# EAGLE design LB_BIT_o9_BARGRAPH-v02(rev1) (EAGLE 6.1)
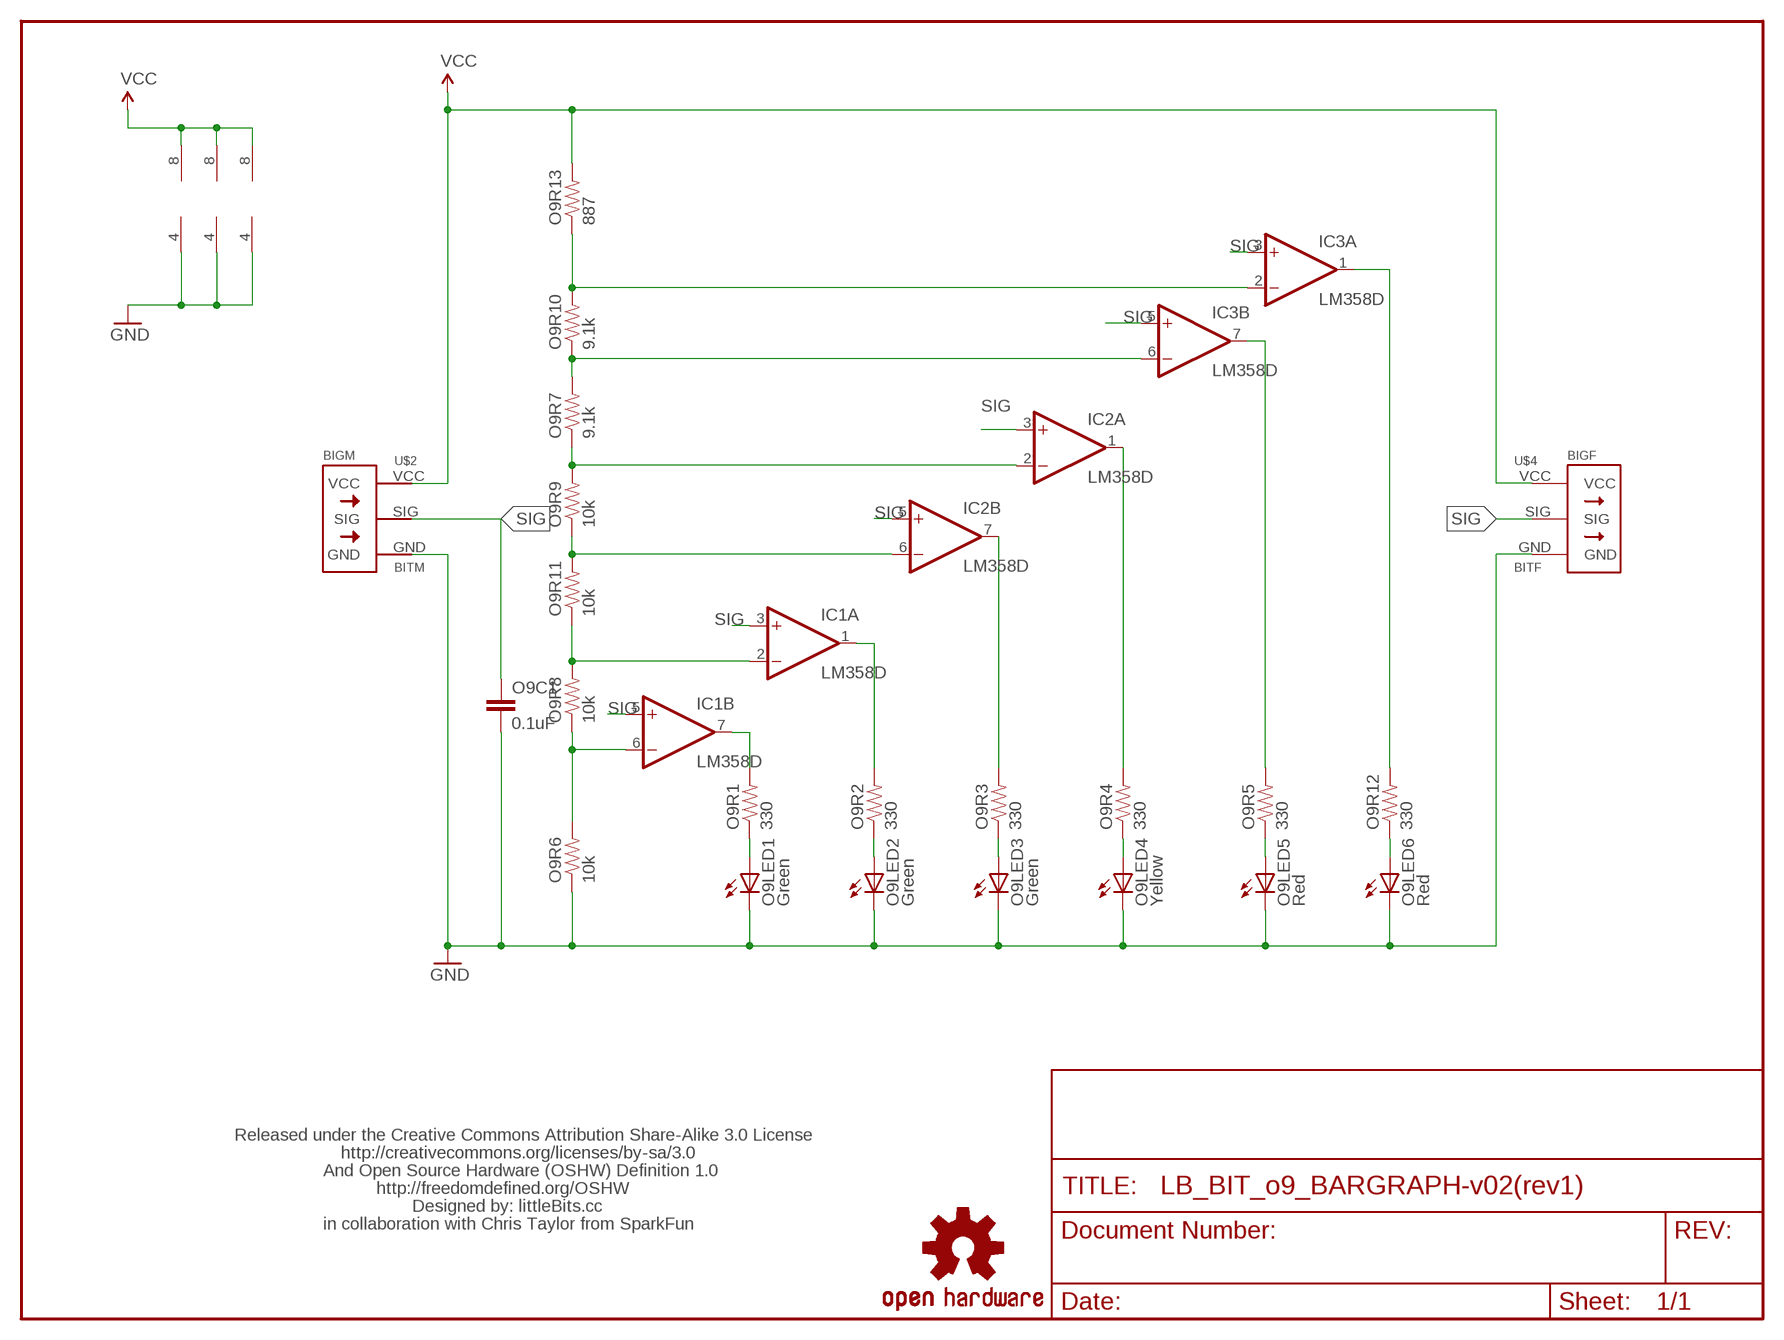
[diagram p0: schematic, sheet 1]

## Parts
IC1  LM358D  [SO08]
IC2  LM358D  [SO08]
IC3  LM358D  [SO08]
O9C1  0.1uF  CAP1206  [1206]
O9LED1  Green  LED1206  [LED-1206]
O9LED2  Green  LED1206  [LED-1206]
O9LED3  Green  LED1206  [LED-1206]
O9LED4  Yellow  LED1206  [LED-1206]
O9LED5  Red  LED1206  [LED-1206]
O9LED6  Red  LED1206  [LED-1206]
O9R1  330  RESISTOR  [0805]
O9R2  330  RESISTOR  [0805]
O9R3  330  RESISTOR  [0805]
O9R4  330  RESISTOR  [0805]
O9R5  330  RESISTOR  [0805]
O9R6  10k  RESISTOR  [0805]
O9R7  9.1k  RESISTOR  [0805]
O9R8  10k  RESISTOR  [0805]
O9R9  10k  RESISTOR  [0805]
O9R10  9.1k  RESISTOR  [0805]
O9R11  10k  RESISTOR  [0805]
O9R12  330  RESISTOR  [0805]
O9R13  887  RESISTOR  [0805]
U$1  LB_CREDITS  [OSHWCREDIT]
U$2  BITM  [BITM]
U$3  OSHW-LOGOL  [OSHW-LOGO-L]
U$4  BITF  [BITM]

## Nets
GND: IC1.4(P:V-) IC2.4(P:V-) IC3.4(P:V-) O9C1.2 O9LED1.C O9LED2.C O9LED3.C O9LED4.C O9LED5.C O9LED6.C O9R6.1 U$2.GND U$4.GND
N$1: IC1.7(B:OUT) O9R1.2
N$2: O9LED1.A O9R1.1
N$3: O9LED2.A O9R2.1
N$4: O9LED3.A O9R3.1
N$5: O9LED4.A O9R4.1
N$6: O9LED5.A O9R5.1
N$7: O9LED6.A O9R12.1
N$8: IC1.1(A:OUT) O9R2.2
N$9: IC2.7(B:OUT) O9R3.2
N$10: IC2.1(A:OUT) O9R4.2
N$11: IC3.1(A:OUT) O9R12.2
N$12: IC3.7(B:OUT) O9R5.2
N$14: IC1.6(B:-IN) O9R6.2 O9R8.1
N$15: IC1.2(A:-IN) O9R8.2 O9R11.1
N$16: IC2.6(B:-IN) O9R9.1 O9R11.2
N$17: IC2.2(A:-IN) O9R7.1 O9R9.2
N$18: IC3.2(A:-IN) O9R10.2 O9R13.1
N$20: IC3.6(B:-IN) O9R7.2 O9R10.1
SIG: IC1.3(A:+IN) IC1.5(B:+IN) IC2.3(A:+IN) IC2.5(B:+IN) IC3.3(A:+IN) IC3.5(B:+IN) O9C1.1 U$2.SIG U$4.SIG
VCC: IC1.8(P:V+) IC2.8(P:V+) IC3.8(P:V+) O9R13.2 U$2.VCC U$4.VCC

## Library data of the parts
IC1-IC3 = linear:LM358: OP AMP also LM158; LM258; LM2904 Source: http://cache.national.com/ds/LM/LM158.pdf
O9C1 = SparkFun:CAP: Capacitor Standard 0603 ceramic capacitor, and 0.1" leaded capacitor.
O9LED1-O9LED6 = SparkFun:LED: LEDs Standard schematic elements and footprints for 5mm, 3mm, 1206, and 0603 sized LEDs. 5mm - Spark Fun Electronics SKU : COM-00529 (and others)
O9R1-O9R13 = SparkFun:RESISTOR: Resistor Basic schematic elements and footprints for 0603, 1206, and PTH 1/10th watt (small) resistors.
U$1 = LITTLEBITS:LB_CREDITS
U$2 = radames:BITM
U$3 = SparkFun:OSHW-LOGO: Open Source Hardware Logo This logo indicates the piece of hardware it is found on incorporates a OSHW license and/or adheres to the definition of open source hardware found here: http://freedomdefined.org/OSHW
U$4 = radames:BITF

## Board
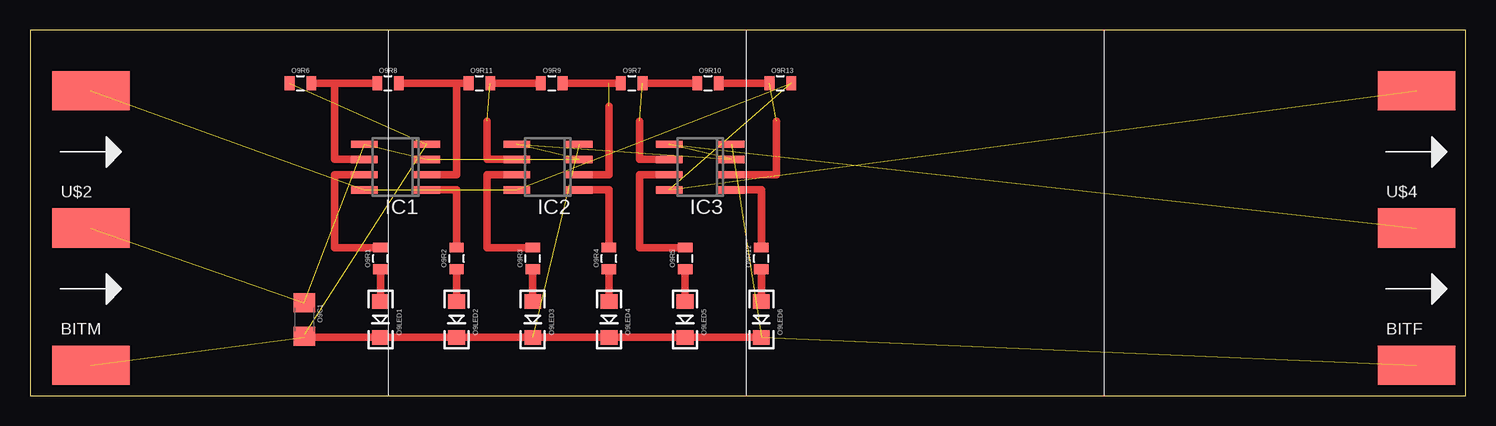
[diagram p1: board, top side]

Size 119.69 x 30.47 mm. Coordinates in mm from the lower left corner, seen from the top.
Outline: 0,0 119.69,0 119.69,30.47 0,30.47 0,0
Copper layers (1*16): Top 0.035mm / dielectric 1.5mm / Bottom 0.035mm
Design rules: minimum track width 10mil, minimum drill 24mil, track to track 8mil, track to pad 8mil, pad to pad 8mil, via to via 8mil, smd to smd 8mil, copper to edge 40mil, drill to drill 8mil, minimum pad ring 10mil, minimum via ring 8mil, stop-mask expansion 4mil, vias tented up to drill 0mil, thermal gap 10mil

### Footprints (pad centres in the part's own frame; a part is rotated, then mirrored left to right if it is on the bottom)
SO08 = smd 0.6 x 2.2: 1 -1.905,-2.6; 2 -0.635,-2.6; 3 0.635,-2.6; 4 1.905,-2.6; 5 1.905,2.6; 6 0.635,2.6; 7 -0.635,2.6; 8 -1.905,2.6
1206 = smd 1.6 x 1.8: 1 -1.4,0; 2 1.4,0
LED-1206 = smd 1.2 x 1.4: A -1.5,0; C 1.5,0
0805 = smd 0.8 x 1.2: 1 -0.9,0; 2 0.9,0
BITM = smd 6.452 x 3.251: GND 3.81,-11.43; SIG 3.81,0; VCC 3.81,11.43

### Placement (x,y rotation side)
IC1  30.48,19.05 90 top
IC2  43.18,19.05 90 top
IC3  55.88,19.05 90 top
O9C1  22.86,6.35 270 top
O9LED1  29.21,6.35 270 top
O9LED2  35.56,6.35 270 top
O9LED3  41.91,6.35 270 top
O9LED4  48.26,6.35 270 top
O9LED5  54.61,6.35 270 top
O9LED6  60.96,6.35 270 top
O9R1  29.21,11.43 90 top
O9R2  35.56,11.43 90 top
O9R3  41.91,11.43 90 top
O9R4  48.26,11.43 90 top
O9R5  54.61,11.43 90 top
O9R6  22.54,26.04 0 top
O9R7  50.16,26.04 0 top
O9R8  29.84,26.04 0 top
O9R9  43.5,26.04 0 top
O9R10  56.52,26.04 0 top
O9R11  37.47,26.04 0 top
O9R12  60.96,11.43 90 top
O9R13  62.55,26.04 0 top
U$1  -49.53,1.27 0 top  (outside the outline)
U$2  1.27,13.97 0 top
U$3  -16.51,30.48 0 top  (outside the outline)
U$4  111.76,13.97 0 top

### Tracks (layer width: path | path; a pad name or v marks a point on that pad's centre or on a via)
GND  (6 unrouted)
  Top 0.61: O9LED6.C O9LED5.C O9LED4.C O9LED3.C O9LED2.C O9LED1.C 22.86,4.85 O9C1.2 22.86,5.08
N$1
  Top 0.61: O9R1.2 25.4,12.33 25.4,18.41 IC1.7
N$2
  Top 0.61: O9R1.1 O9LED1.A
N$3
  Top 0.61: O9R2.1 O9LED2.A
N$4
  Top 0.61: O9R3.1 O9LED3.A
N$5
  Top 0.61: O9R4.1 O9LED4.A
N$6
  Top 0.61: O9R5.1 O9LED5.A
N$7
  Top 0.61: O9R12.1 O9LED6.A
N$8
  Top 0.61: O9R2.2 35.56,17.14 IC1.1
N$9
  Top 0.61: O9R3.2 38.1,12.33 38.1,18.41 IC2.7
N$10
  Top 0.61: O9R4.2 48.26,17.14 IC2.1
N$11
  Top 0.61: O9R12.2 60.96,17.14 IC3.1
N$12
  Top 0.61: O9R5.2 50.8,12.33 50.8,18.41 IC3.7
N$14
  Top 0.61: O9R6.2 25.4,26.04 | 25.4,26.04 O9R8.1 | IC1.6 25.4,19.68 25.4,26.04
N$15
  Top 0.61: O9R8.2 35.56,26.04 | 35.56,26.04 O9R11.1 | IC1.2 35.56,18.41 35.56,26.04
N$16  (1 unrouted)
  Top 0.61: O9R11.2 O9R9.1 | IC2.6 38.1,19.68 38.1,22.86
N$17  (1 unrouted)
  Top 0.61: O9R9.2 O9R7.1 | IC2.2 48.26,18.41 48.26,24.13
N$18  (1 unrouted)
  Top 0.61: O9R10.2 O9R13.1 | IC3.2 62.23,18.41 62.23,22.86
N$20  (1 unrouted)
  Top 0.61: O9R7.2 O9R10.1 | IC3.6 50.8,19.68 50.8,22.86
SIG  (8 unrouted)
VCC  (5 unrouted)